# Altium project DB10012_IMU.PrjPcb
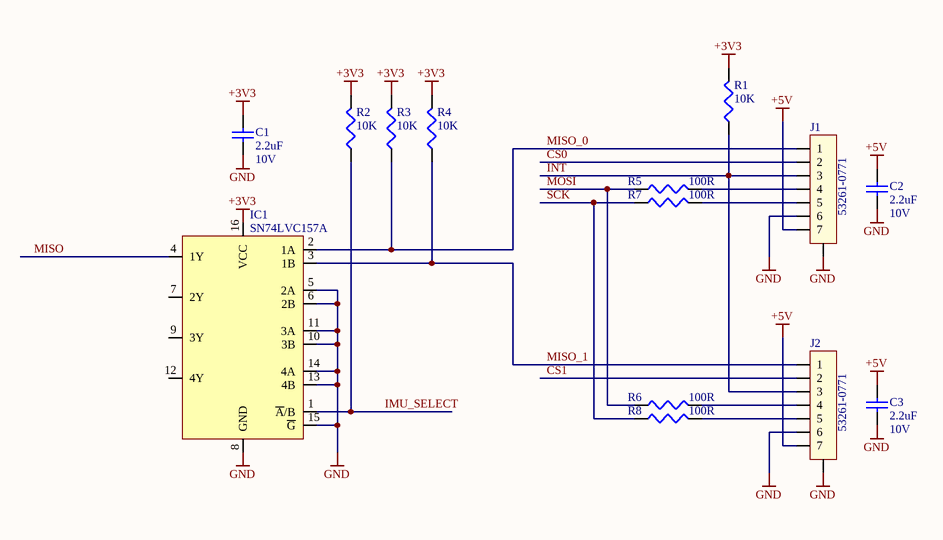
[diagram p0: DB10012_IMUTopLevel.SchDoc]
1 sheet, 14 parts. Net scope: global (net labels, ports and power ports of the same name join across sheets).
Board file: DB10012_IMU.PcbDoc

## Sheet DB10012_IMUTopLevel.SchDoc
size A4

### Parts
C1  2.2uF  Voltage Rating: 10V  [C0603]
C2  2.2uF  Voltage Rating: 10V  [C0603]
C3  2.2uF  Voltage Rating: 10V  [C0603]
IC1  SN74LVC157A  [TSSOP16]
J1  53261-0771  [53261-0771]
J2  53261-0771  [53261-0771]
R1  10K  [0603]
R2  10K  [0603]
R3  10K  [0603]
R4  10K  [0603]
R5  100R  [0603]
R6  100R  [0603]
R7  100R  [0603]
R8  100R  [0603]

### Nets
+3V3: C1.2 IC1.16(VCC) R1.2 R2.2 R3.2 R4.2
+5V: C2.2 C3.2 J1.7 J2.7
GND: C1.1 C2.1 C3.1 IC1.5(2A) IC1.6(2B) IC1.8(GND) IC1.10(3B) IC1.11(3A) IC1.13(4B) IC1.14(4A) IC1.15(~{G}) J1.0(SHLD) J1.6 J2.0(SHLD) J2.6
CS0: J1.2
CS1: J2.2
IMU_SELECT: IC1.1(~{A}/B) R2.1
INT: J1.3 J2.3 R1.1
MISO: IC1.4(1Y)
MISO_0: IC1.2(1A) J1.1 R3.1
MISO_1: IC1.3(1B) J2.1 R4.1
MOSI: R5.1 R6.1
SCK: R7.1 R8.1
NetJ1_4: J1.4 R5.2
NetJ1_5: J1.5 R7.2
NetJ2_4: J2.4 R6.2
NetJ2_5: J2.5 R8.2

Not connected (* = marked no-connect by the designer): IC1 7(2Y) 9(3Y) 12(4Y)

### Library data of the parts
C1-C3 = 2.2uF/0603/CER/10V/X5R: Capacitor, 2.2uF, 10V, X5R; Capacitance Tolerance: ± 10%; Brand Number: GRM188R61A225ME34D; Brand: MURATA; Dielectric Characteristic: X5R; Capacitance: 2.2uF; Capacitor Case Style: C0603; Temperature Range: -55°C to +85°C; Price: 0,008; Order Code Supplier: 2426956; Supplier: Farnell
IC1 = SN74LVC157A: 8:4 DATA SELECTOR/MUX; Brand: Texas Instruments; Brand Number: SN74LVC157APWRE4; Case Style: TSSOP; Order Code Supplier: 1236315; Price: 0,21; Supplier: Farnell; Temperature Range: -55°C to +155°C
J1 J2 = 53261-0771: PicoBlade 53261 Series, 7Pin, Right Angle; Brand: Molex; Pitch: 1,25mm; Brand Number: 53261-0771; Case Style: 53261-0771; Order Code Supplier: 1125361; Price: 1,80; Supplier: Farnell
R1-R4 = 10K/0603/0063W/50V: Resistor, 10K, 1%, 0.063W, 50V, 100PPM, 0603; Brand: VISHAY DRALORIC; Brand Number: CRCW060310K0FKEA; Case Style: 0603; Order Code Supplier: 2122493; Power Rating: 0.063W; Price: 0,038; Resistance: 10K; Supplier: Farnell; Temperature Coefficient: ± 100PPM; Temperature Range: -55°C to +125°C; Voltage Rating: 50V
R5-R8 = 100/0603/0063W/50V: Resistor, 100R, 1%, 0.063W, 50V, 200PPM, 0603; Brand: VISHAY DRALORIC; Brand Number: CRCW0603100RFKEA; Case Style: 0603; Order Code Supplier: 2122239; Power Rating: 0.063W; Price: 0,007; Resistance: 100R; Supplier: Farnell; Temperature Coefficient: ± 200PPM; Temperature Range: -55°C to +125°C; Voltage Rating: 50V